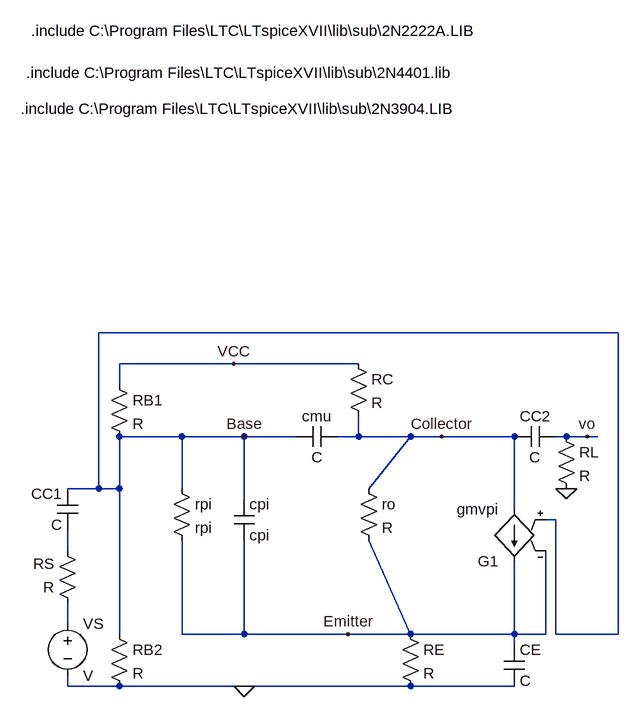
[diagram p0: schematic mp2 task2 small signal AC model.asc]
mp2 task2 small signal AC model.asc, the LTspice schematic file:
Version 4
SHEET 1 1284 804
WIRE 816 48 16 48
WIRE 224 96 48 96
WIRE 416 96 224 96
WIRE 48 128 48 96
WIRE 144 208 48 208
WIRE 240 208 144 208
WIRE 320 208 240 208
WIRE 416 208 416 176
WIRE 416 208 384 208
WIRE 496 208 416 208
WIRE 544 208 496 208
WIRE 656 208 544 208
WIRE 736 208 720 208
WIRE 768 208 736 208
WIRE 784 208 768 208
WIRE 16 288 16 48
WIRE 16 288 -32 288
WIRE 48 288 48 208
WIRE 48 288 16 288
WIRE 144 288 144 208
WIRE 432 288 496 208
WIRE 240 304 240 208
WIRE 656 320 656 208
WIRE 720 336 704 336
WIRE -32 384 -32 352
WIRE -32 496 -32 464
WIRE 48 512 48 288
WIRE 144 512 144 368
WIRE 240 512 240 368
WIRE 240 512 144 512
WIRE 400 512 240 512
WIRE 496 512 432 368
WIRE 496 512 400 512
WIRE 656 512 656 400
WIRE 656 512 496 512
WIRE 704 512 704 384
WIRE 704 512 656 512
WIRE 720 512 720 336
WIRE 816 512 816 48
WIRE 816 512 720 512
WIRE 656 528 656 512
WIRE -32 592 -32 576
WIRE 48 592 -32 592
WIRE 240 592 48 592
WIRE 496 592 240 592
WIRE 656 592 496 592
FLAG 224 96 VCC
FLAG 400 512 Emitter
FLAG 544 208 Collector
FLAG 240 208 Base
FLAG 736 288 0
FLAG 240 592 0
FLAG 768 208 vo
SYMBOL res 32 112 R0
SYMATTR InstName RB1
SYMBOL res 400 80 R0
SYMATTR InstName RC
SYMBOL res 32 496 R0
SYMATTR InstName RB2
SYMBOL res 480 496 R0
SYMATTR InstName RE
SYMBOL cap -16 352 R180
WINDOW 0 24 56 Left 2
WINDOW 3 24 8 Left 2
SYMATTR InstName CC1
SYMBOL res -16 480 R180
WINDOW 0 36 76 Left 2
WINDOW 3 36 40 Left 2
SYMATTR InstName RS
SYMBOL cap 640 528 R0
SYMATTR InstName CE
SYMBOL cap 720 192 R90
WINDOW 0 0 32 VBottom 2
WINDOW 3 32 32 VTop 2
SYMATTR InstName CC2
SYMBOL res 720 192 R0
SYMATTR InstName RL
SYMBOL voltage -32 480 R0
SYMATTR InstName VS
SYMBOL res 416 272 R0
SYMATTR InstName ro
SYMBOL g2 656 416 R180
SYMATTR InstName G1
SYMATTR Value gmvpi
SYMBOL cap 384 192 R90
WINDOW 0 0 32 VBottom 2
WINDOW 3 32 32 VTop 2
SYMATTR InstName cmu
SYMBOL res 128 272 R0
SYMATTR InstName rpi
SYMATTR Value rpi
SYMBOL cap 224 304 R0
SYMATTR InstName cpi
SYMATTR Value cpi
TEXT -104 -296 Left 2 !.include C:\\Program Files\\LTC\\LTspiceXVII\\lib\\sub\\2N3904.LIB
TEXT -96 -352 Left 2 !.include C:\\Program Files\\LTC\\LTspiceXVII\\lib\\sub\\2N4401.lib
TEXT -88 -416 Left 2 !.include C:\\Program Files\\LTC\\LTspiceXVII\\lib\\sub\\2N2222A.LIB

The netlist it stands for:
* mp2 task2 small signal AC model.asc
RB1 VCC Base R
RC VCC Collector R
RB2 Base 0 R
RE Emitter 0 R
CC1 N001 Base C
RS N002 N001 R
CE Emitter 0 C
CC2 vo Collector C
RL vo 0 R
VS N002 0 V
ro Collector Emitter R
G1 Collector Emitter Base Emitter gmvpi
cmu Collector Base C
rpi Base Emitter rpi
cpi Base Emitter cpi
.include C:\Program Files\LTC\LTspiceXVII\lib\sub\2N3904.LIB
.include C:\Program Files\LTC\LTspiceXVII\lib\sub\2N4401.lib
.include C:\Program Files\LTC\LTspiceXVII\lib\sub\2N2222A.LIB
.backanno
.end